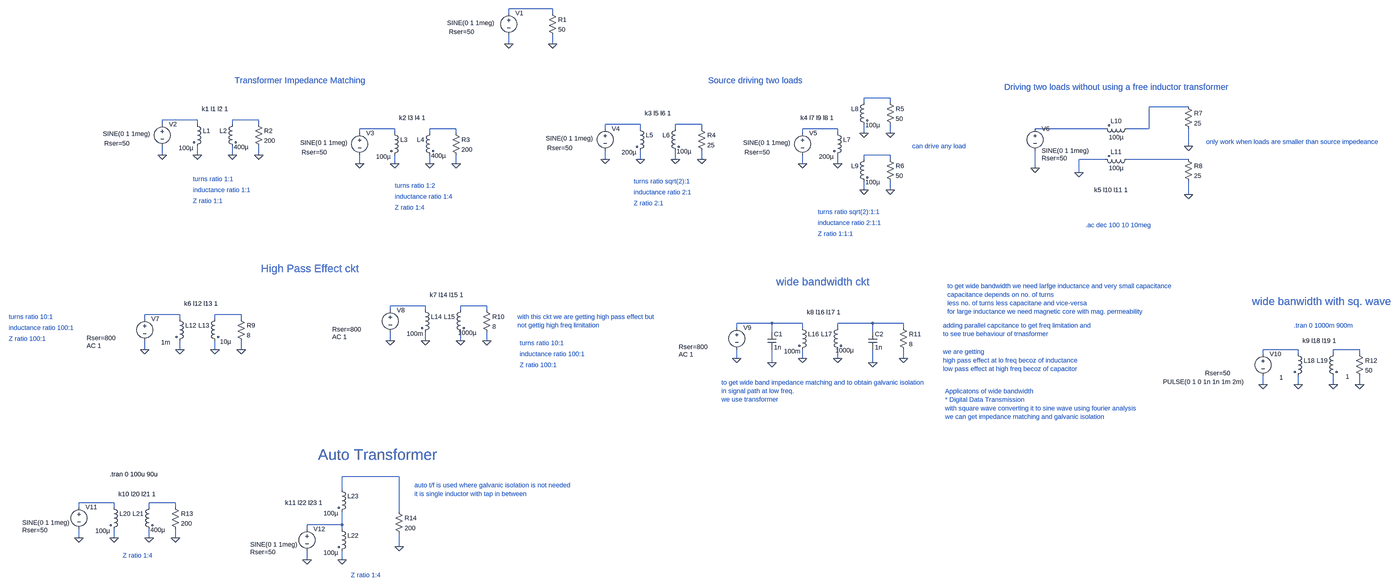
[diagram p0: schematic Wideband coupling (High coupling factor)- Transformer Impedance matching.asc, whole sheet]
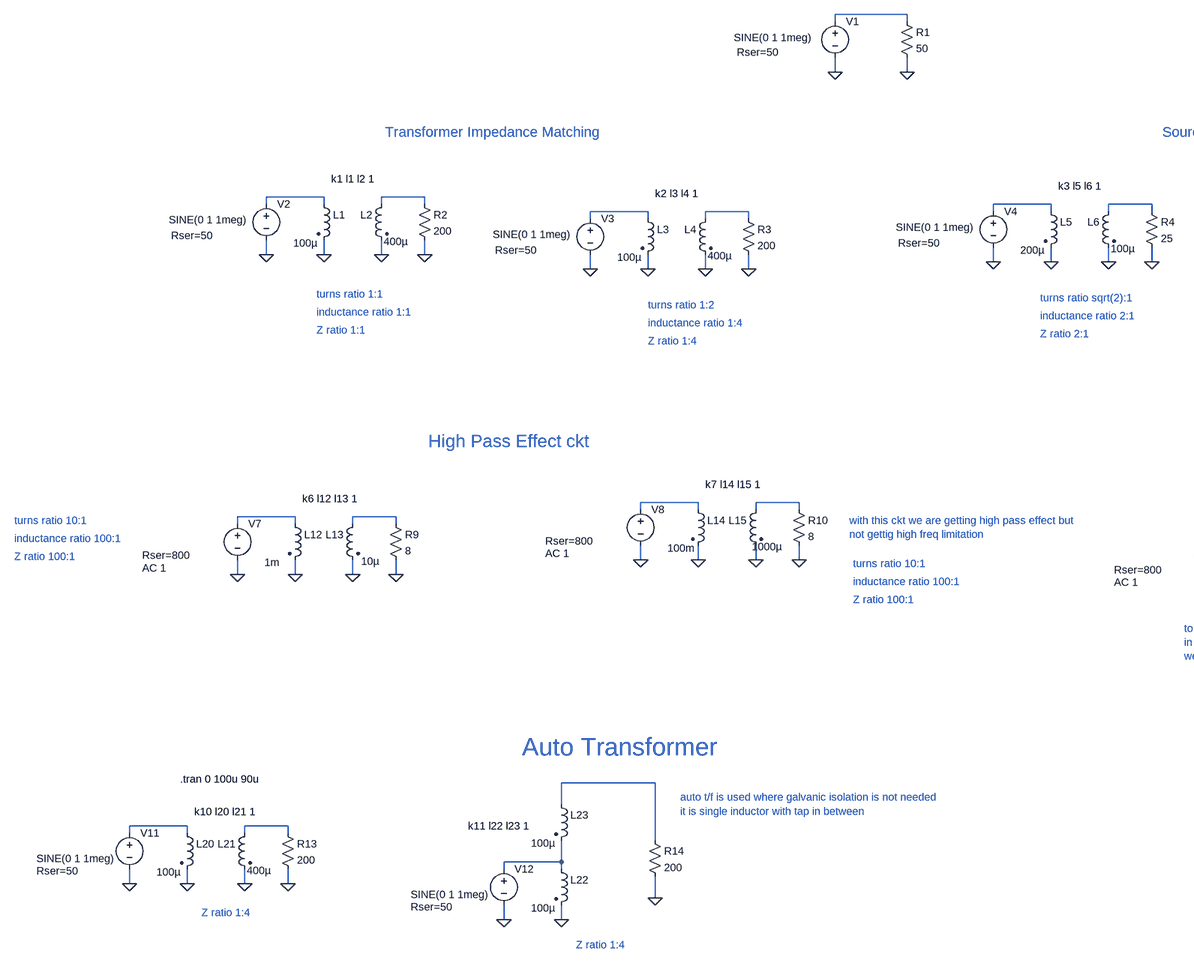
[diagram p1: schematic Wideband coupling (High coupling factor)- Transformer Impedance matching.asc, part, row 1 of 1, column 1 of 2]
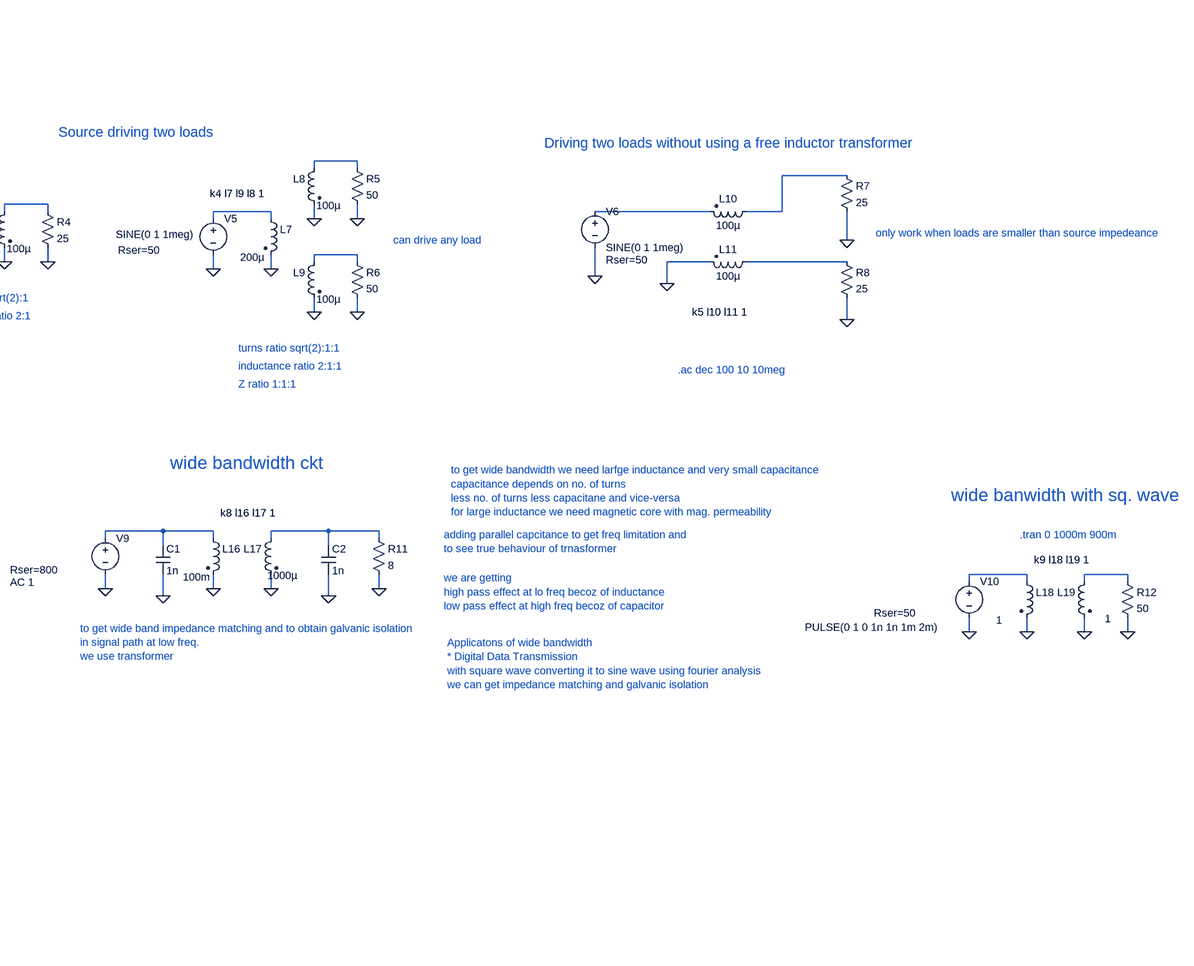
[diagram p2: schematic Wideband coupling (High coupling factor)- Transformer Impedance matching.asc, part, row 1 of 1, column 2 of 2]
Wideband coupling (High coupling factor)- Transformer Impedance matching.asc, the LTspice schematic file:
Version 4
SHEET 1 4592 2796
WIRE 1472 16 1312 16
WIRE 1312 32 1312 16
WIRE 1472 32 1472 16
WIRE 1312 144 1312 112
WIRE 1472 144 1472 112
WIRE 2704 352 2608 352
WIRE 2608 368 2608 352
WIRE 2704 368 2704 352
WIRE 3792 384 3648 384
WIRE 176 432 48 432
WIRE 400 432 304 432
WIRE 48 448 48 432
WIRE 176 448 176 432
WIRE 304 448 304 432
WIRE 400 448 400 432
WIRE 1792 448 1664 448
WIRE 2016 448 1920 448
WIRE 896 464 768 464
WIRE 1120 464 1024 464
WIRE 1664 464 1664 448
WIRE 1792 464 1792 448
WIRE 1920 464 1920 448
WIRE 2016 464 2016 448
WIRE 2512 464 2384 464
WIRE 3488 464 3232 464
WIRE 3648 464 3648 384
WIRE 3648 464 3568 464
WIRE 768 480 768 464
WIRE 896 480 896 464
WIRE 1024 480 1024 464
WIRE 1120 480 1120 464
WIRE 2384 480 2384 464
WIRE 2512 480 2512 464
WIRE 2608 480 2608 448
WIRE 2704 480 2704 448
WIRE 3792 528 3792 464
WIRE 48 560 48 528
WIRE 176 560 176 528
WIRE 304 560 304 528
WIRE 400 560 400 528
WIRE 2704 560 2608 560
WIRE 1664 576 1664 544
WIRE 1792 576 1792 544
WIRE 1920 576 1920 544
WIRE 2016 576 2016 544
WIRE 2608 576 2608 560
WIRE 2704 576 2704 560
WIRE 3488 576 3392 576
WIRE 3792 576 3568 576
WIRE 768 592 768 560
WIRE 896 592 896 560
WIRE 1024 592 1024 560
WIRE 1120 592 1120 560
WIRE 2384 592 2384 560
WIRE 2512 592 2512 560
WIRE 3232 608 3232 544
WIRE 3392 624 3392 576
WIRE 2608 688 2608 656
WIRE 2704 688 2704 656
WIRE 3792 704 3792 656
WIRE 1008 1184 880 1184
WIRE 1232 1184 1136 1184
WIRE 880 1200 880 1184
WIRE 1008 1200 1008 1184
WIRE 1136 1200 1136 1184
WIRE 1232 1200 1232 1184
WIRE 112 1216 -16 1216
WIRE 336 1216 240 1216
WIRE -16 1232 -16 1216
WIRE 112 1232 112 1216
WIRE 240 1232 240 1216
WIRE 336 1232 336 1216
WIRE 2272 1248 2144 1248
WIRE 2384 1248 2272 1248
WIRE 2640 1248 2512 1248
WIRE 2752 1248 2640 1248
WIRE 2144 1264 2144 1248
WIRE 2384 1264 2384 1248
WIRE 2512 1264 2512 1248
WIRE 2752 1264 2752 1248
WIRE 2272 1280 2272 1248
WIRE 2640 1280 2640 1248
WIRE 880 1312 880 1280
WIRE 1008 1312 1008 1280
WIRE 1136 1312 1136 1280
WIRE 1232 1312 1232 1280
WIRE -16 1344 -16 1312
WIRE 112 1344 112 1312
WIRE 240 1344 240 1312
WIRE 336 1344 336 1312
WIRE 4192 1344 4064 1344
WIRE 4416 1344 4320 1344
WIRE 4064 1360 4064 1344
WIRE 4192 1360 4192 1344
WIRE 4320 1360 4320 1344
WIRE 4416 1360 4416 1344
WIRE 2144 1376 2144 1344
WIRE 2384 1376 2384 1344
WIRE 2512 1376 2512 1344
WIRE 2752 1376 2752 1344
WIRE 2272 1392 2272 1344
WIRE 2640 1392 2640 1344
WIRE 4064 1472 4064 1440
WIRE 4192 1472 4192 1440
WIRE 4320 1472 4320 1440
WIRE 4416 1472 4416 1440
WIRE 912 1856 704 1856
WIRE 704 1904 704 1856
WIRE -128 1952 -256 1952
WIRE 96 1952 0 1952
WIRE -256 1968 -256 1952
WIRE -128 1968 -128 1952
WIRE 0 1968 0 1952
WIRE 96 1968 96 1952
WIRE 912 1984 912 1856
WIRE 704 2032 704 1984
WIRE 704 2032 576 2032
WIRE 576 2048 576 2032
WIRE 704 2048 704 2032
WIRE -256 2080 -256 2048
WIRE -128 2080 -128 2048
WIRE 0 2080 0 2048
WIRE 96 2080 96 2048
WIRE 912 2112 912 2064
WIRE 576 2160 576 2128
WIRE 704 2160 704 2128
FLAG 1312 144 0
FLAG 1472 144 0
FLAG 400 560 0
FLAG 304 560 0
FLAG 176 560 0
FLAG 48 560 0
FLAG 1120 592 0
FLAG 1024 592 0
FLAG 896 592 0
FLAG 768 592 0
FLAG 2016 576 0
FLAG 1920 576 0
FLAG 1792 576 0
FLAG 1664 576 0
FLAG 2512 592 0
FLAG 2384 592 0
FLAG 2704 480 0
FLAG 2608 480 0
FLAG 2704 688 0
FLAG 2608 688 0
FLAG 3232 608 0
FLAG 3392 624 0
FLAG 3792 528 0
FLAG 3792 704 0
FLAG 336 1344 0
FLAG 240 1344 0
FLAG 112 1344 0
FLAG -16 1344 0
FLAG 1232 1312 0
FLAG 1136 1312 0
FLAG 1008 1312 0
FLAG 880 1312 0
FLAG 2752 1376 0
FLAG 2512 1376 0
FLAG 2384 1376 0
FLAG 2144 1376 0
FLAG 2272 1392 0
FLAG 2640 1392 0
FLAG 4416 1472 0
FLAG 4320 1472 0
FLAG 4192 1472 0
FLAG 4064 1472 0
FLAG 96 2080 0
FLAG 0 2080 0
FLAG -128 2080 0
FLAG -256 2080 0
FLAG 704 2160 0
FLAG 576 2160 0
FLAG 912 2112 0
SYMBOL res 1456 16 R0
SYMATTR InstName R1
SYMATTR Value 50
SYMBOL voltage 1312 16 R0
WINDOW 3 -225 52 Left 2
WINDOW 123 0 0 Left 0
WINDOW 39 -218 84 Left 2
SYMATTR InstName V1
SYMATTR Value SINE(0 1 1meg)
SYMATTR SpiceLine Rser=50
SYMBOL voltage 48 432 R0
WINDOW 3 -217 51 Left 2
WINDOW 123 0 0 Left 0
WINDOW 39 -212 86 Left 2
SYMATTR InstName V2
SYMATTR Value SINE(0 1 1meg)
SYMATTR SpiceLine Rser=50
SYMBOL ind2 160 432 R0
WINDOW 3 -52 102 Left 2
SYMATTR InstName L1
SYMATTR Value 100µ
SYMBOL ind2 320 432 M0
WINDOW 3 -43 99 Left 2
SYMATTR InstName L2
SYMATTR Value 400µ
SYMBOL res 384 432 R0
SYMATTR InstName R2
SYMATTR Value 200
SYMBOL voltage 768 464 R0
WINDOW 3 -217 51 Left 2
WINDOW 123 0 0 Left 0
WINDOW 39 -212 86 Left 2
SYMATTR InstName V3
SYMATTR Value SINE(0 1 1meg)
SYMATTR SpiceLine Rser=50
SYMBOL ind2 880 464 R0
WINDOW 3 -52 102 Left 2
SYMATTR InstName L3
SYMATTR Value 100µ
SYMBOL ind2 1040 464 M0
WINDOW 3 -43 99 Left 2
SYMATTR InstName L4
SYMATTR Value 400µ
SYMBOL res 1104 464 R0
SYMATTR InstName R3
SYMATTR Value 200
SYMBOL voltage 1664 448 R0
WINDOW 3 -217 51 Left 2
WINDOW 123 0 0 Left 0
WINDOW 39 -212 86 Left 2
SYMATTR InstName V4
SYMATTR Value SINE(0 1 1meg)
SYMATTR SpiceLine Rser=50
SYMBOL ind2 1776 448 R0
WINDOW 3 -52 102 Left 2
SYMATTR InstName L5
SYMATTR Value 200µ
SYMBOL ind2 1936 448 M0
WINDOW 3 -43 99 Left 2
SYMATTR InstName L6
SYMATTR Value 100µ
SYMBOL res 2000 448 R0
SYMATTR InstName R4
SYMATTR Value 25
SYMBOL voltage 2384 464 R0
WINDOW 3 -217 51 Left 2
WINDOW 123 0 0 Left 0
WINDOW 39 -212 86 Left 2
SYMATTR InstName V5
SYMATTR Value SINE(0 1 1meg)
SYMATTR SpiceLine Rser=50
SYMBOL ind2 2496 464 R0
WINDOW 3 -52 102 Left 2
SYMATTR InstName L7
SYMATTR Value 200µ
SYMBOL ind2 2624 352 M0
WINDOW 3 -43 99 Left 2
SYMATTR InstName L8
SYMATTR Value 100µ
SYMBOL res 2688 352 R0
SYMATTR InstName R5
SYMATTR Value 50
SYMBOL ind2 2624 560 M0
WINDOW 3 -43 99 Left 2
SYMATTR InstName L9
SYMATTR Value 100µ
SYMBOL res 2688 560 R0
SYMATTR InstName R6
SYMATTR Value 50
SYMBOL voltage 3232 448 R0
WINDOW 123 0 0 Left 0
WINDOW 39 24 124 Left 2
SYMATTR InstName V6
SYMATTR Value SINE(0 1 1meg)
SYMATTR SpiceLine Rser=50
SYMBOL ind2 3584 448 R90
WINDOW 0 4 56 VBottom 2
WINDOW 3 32 56 VTop 2
SYMATTR InstName L10
SYMATTR Value 100µ
SYMBOL ind2 3584 560 R90
WINDOW 0 4 56 VBottom 2
WINDOW 3 32 56 VTop 2
SYMATTR InstName L11
SYMATTR Value 100µ
SYMBOL res 3776 368 R0
SYMATTR InstName R7
SYMATTR Value 25
SYMBOL res 3776 560 R0
SYMATTR InstName R8
SYMATTR Value 25
SYMBOL voltage -16 1216 R0
WINDOW 3 -217 51 Left 2
WINDOW 123 -212 114 Left 2
WINDOW 39 -212 86 Left 2
SYMATTR InstName V7
SYMATTR Value ""
SYMATTR Value2 AC 1
SYMATTR SpiceLine Rser=800
SYMBOL ind2 96 1216 R0
WINDOW 3 -52 102 Left 2
SYMATTR InstName L12
SYMATTR Value 1m
SYMBOL ind2 256 1216 M0
WINDOW 3 -43 99 Left 2
SYMATTR InstName L13
SYMATTR Value 10µ
SYMBOL res 320 1216 R0
SYMATTR InstName R9
SYMATTR Value 8
SYMBOL voltage 880 1184 R0
WINDOW 3 -217 51 Left 2
WINDOW 123 -212 114 Left 2
WINDOW 39 -212 86 Left 2
SYMATTR InstName V8
SYMATTR Value ""
SYMATTR Value2 AC 1
SYMATTR SpiceLine Rser=800
SYMBOL ind2 992 1184 R0
WINDOW 3 -52 102 Left 2
SYMATTR InstName L14
SYMATTR Value 100m
SYMBOL ind2 1152 1184 M0
WINDOW 3 -43 99 Left 2
SYMATTR InstName L15
SYMATTR Value 1000µ
SYMBOL res 1216 1184 R0
SYMATTR InstName R10
SYMATTR Value 8
SYMBOL voltage 2144 1248 R0
WINDOW 3 -217 51 Left 2
WINDOW 123 -212 114 Left 2
WINDOW 39 -212 86 Left 2
SYMATTR InstName V9
SYMATTR Value ""
SYMATTR Value2 AC 1
SYMATTR SpiceLine Rser=800
SYMBOL ind2 2368 1248 R0
WINDOW 3 -52 102 Left 2
SYMATTR InstName L16
SYMATTR Value 100m
SYMBOL ind2 2528 1248 M0
WINDOW 3 -43 99 Left 2
SYMATTR InstName L17
SYMATTR Value 1000µ
SYMBOL res 2736 1248 R0
SYMATTR InstName R11
SYMATTR Value 8
SYMBOL cap 2256 1280 R0
SYMATTR InstName C1
SYMATTR Value 1n
SYMBOL cap 2624 1280 R0
SYMATTR InstName C2
SYMATTR Value 1n
SYMBOL voltage 4064 1344 R0
WINDOW 3 -365 118 Left 2
WINDOW 123 -212 114 Left 2
WINDOW 39 -212 86 Left 2
SYMATTR InstName V10
SYMATTR Value PULSE(0 1 0 1n 1n 1m 2m)
SYMATTR SpiceLine Rser=50
SYMBOL ind2 4176 1344 R0
WINDOW 3 -52 102 Left 2
SYMATTR InstName L18
SYMATTR Value 1
SYMBOL ind2 4336 1344 M0
WINDOW 3 -43 99 Left 2
SYMATTR InstName L19
SYMATTR Value 1
SYMBOL res 4400 1344 R0
SYMATTR InstName R12
SYMATTR Value 50
SYMBOL ind2 -144 1952 R0
WINDOW 3 -52 102 Left 2
SYMATTR InstName L20
SYMATTR Value 100µ
SYMBOL ind2 16 1952 M0
WINDOW 3 -43 99 Left 2
SYMATTR InstName L21
SYMATTR Value 400µ
SYMBOL res 80 1952 R0
SYMATTR InstName R13
SYMATTR Value 200
SYMBOL voltage -256 1952 R0
WINDOW 3 -207 72 Left 2
WINDOW 123 0 0 Left 0
WINDOW 39 -207 100 Left 2
SYMATTR InstName V11
SYMATTR Value SINE(0 1 1meg)
SYMATTR SpiceLine Rser=50
SYMBOL ind2 688 2032 R0
WINDOW 3 -52 102 Left 2
SYMATTR InstName L22
SYMATTR Value 100µ
SYMBOL voltage 576 2032 R0
WINDOW 3 -207 72 Left 2
WINDOW 123 0 0 Left 0
WINDOW 39 -207 100 Left 2
SYMATTR InstName V12
SYMATTR Value SINE(0 1 1meg)
SYMATTR SpiceLine Rser=50
SYMBOL ind2 688 1888 R0
WINDOW 3 -52 102 Left 2
SYMATTR InstName L23
SYMATTR Value 100µ
SYMBOL res 896 1968 R0
SYMATTR InstName R14
SYMATTR Value 200
TEXT 160 648 Left 2 ;turns ratio 1:1
TEXT 160 688 Left 2 ;inductance ratio 1:1
TEXT 160 728 Left 2 ;Z ratio 1:1
TEXT 192 392 Left 2 !k1 l1 l2 1
TEXT 896 672 Left 2 ;turns ratio 1:2
TEXT 896 712 Left 2 ;inductance ratio 1:4
TEXT 896 752 Left 2 ;Z ratio 1:4
TEXT 912 424 Left 2 !k2 l3 l4 1
TEXT 312 288 Left 3 ;Transformer Impedance Matching
TEXT 1768 656 Left 2 ;turns ratio sqrt(2):1
TEXT 1768 696 Left 2 ;inductance ratio 2:1
TEXT 1768 736 Left 2 ;Z ratio 2:1
TEXT 1808 408 Left 2 !k3 l5 l6 1
TEXT 2440 768 Left 2 ;turns ratio sqrt(2):1:1
TEXT 2440 808 Left 2 ;inductance ratio 2:1:1
TEXT 2440 848 Left 2 ;Z ratio 1:1:1
TEXT 2376 424 Left 2 !k4 l7 l9 l8 1
TEXT 2040 288 Left 3 ;Source driving two loads
TEXT 3120 312 Left 3 ;Driving two loads without using a free inductor transformer
TEXT 3448 688 Left 2 !k5 l10 l11 1
TEXT 3856 512 Left 2 ;only work when loads are smaller than source impedeance
TEXT 2784 528 Left 2 ;can drive any load
TEXT -512 1224 Left 2 ;turns ratio 10:1
TEXT -512 1264 Left 2 ;inductance ratio 100:1
TEXT -512 1304 Left 2 ;Z ratio 100:1
TEXT 128 1176 Left 2 !k6 l12 l13 1
TEXT 1352 1320 Left 2 ;turns ratio 10:1
TEXT 1352 1360 Left 2 ;inductance ratio 100:1
TEXT 1352 1400 Left 2 ;Z ratio 100:1
TEXT 1024 1144 Left 2 !k7 l14 l15 1
TEXT 1344 1224 Left 2 ;with this ckt we are getting high pass effect but \nnot gettig high freq limitation
TEXT 2400 1208 Left 2 !k8 l16 l17 1
TEXT 2896 1256 Left 2 ;adding parallel capcitance to get freq limitation and \nto see true behaviour of trnasformer
TEXT 2896 1352 Left 2 ;we are getting \nhigh pass effect at lo freq becoz of inductance \nlow pass effect at high freq becoz of capacitor
TEXT 2288 1096 Left 4 ;wide bandwidth ckt
TEXT 2912 1112 Left 2 ;to get wide bandwidth we need larfge inductance and very small capacitance\ncapacitance depends on no. of turns\nless no. of turns less capacitane and vice-versa\nfor large inductance we need magnetic core with mag. permeability
TEXT 2088 1464 Left 2 ;to get wide band impedance matching and to obtain galvanic isolation \nin signal path at low freq.\nwe use transformer
TEXT 2904 1496 Left 2 ;Applicatons of wide bandwidth \n* Digital Data Transmission\nwith square wave converting it to sine wave using fourier analysis\nwe can get impedance matching and galvanic isolation
TEXT 4208 1312 Left 2 !k9 l18 l19 1
TEXT 3416 816 Left 2 ;.ac dec 100 10 10meg
TEXT -112 1920 Left 2 !k10 l20 l21 1
TEXT -96 2144 Left 2 ;Z ratio 1:4
TEXT 496 1952 Left 2 !k11 l22 l23 1
TEXT 736 2216 Left 2 ;Z ratio 1:4
TEXT 4176 1256 Left 2 ;.tran 0 1000m 900m
TEXT -144 1848 Left 2 !.tran 0 100u 90u
TEXT 616 1776 Left 5 ;Auto Transformer
TEXT 968 1888 Left 2 ;auto t/f is used where galvanic isolation is not needed\nit is single inductor with tap in between
TEXT 4024 1168 Left 4 ;wide banwidth with sq. wave
TEXT 408 1048 Left 4 ;High Pass Effect ckt

The netlist it stands for:
* Wideband coupling (High coupling factor)- Transformer Impedance matching.asc
R1 N001 0 50
V1 N001 0 SINE(0 1 1meg) Rser=50
V2 N004 0 SINE(0 1 1meg) Rser=50
L1 N004 0 100µ
L2 N005 0 400µ
R2 N005 0 200
V3 N008 0 SINE(0 1 1meg) Rser=50
L3 N008 0 100µ
L4 N009 0 400µ
R3 N009 0 200
V4 N006 0 SINE(0 1 1meg) Rser=50
L5 N006 0 200µ
L6 N007 0 100µ
R4 N007 0 25
V5 N010 0 SINE(0 1 1meg) Rser=50
L7 N010 0 200µ
L8 N002 0 100µ
R5 N002 0 50
L9 N012 0 100µ
R6 N012 0 50
V6 N011 0 SINE(0 1 1meg) Rser=50
L10 N003 N011 100µ
L11 N013 0 100µ
R7 N003 0 25
R8 N013 0 25
V7 N016 0 AC 1 Rser=800
L12 N016 0 1m
L13 N017 0 10µ
R9 N017 0 8
V8 N014 0 AC 1 Rser=800
L14 N014 0 100m
L15 N015 0 1000µ
R10 N015 0 8
V9 N018 0 AC 1 Rser=800
L16 N018 0 100m
L17 N019 0 1000µ
R11 N019 0 8
C1 N018 0 1n
C2 N019 0 1n
V10 N020 0 PULSE(0 1 0 1n 1n 1m 2m) Rser=50
L18 N020 0 1
L19 N021 0 1
R12 N021 0 50
L20 N023 0 100µ
L21 N024 0 400µ
R13 N024 0 200
V11 N023 0 SINE(0 1 1meg) Rser=50
L22 N025 0 100µ
V12 N025 0 SINE(0 1 1meg) Rser=50
L23 N022 N025 100µ
R14 N022 0 200
* turns ratio 1:1
* inductance ratio 1:1
* Z ratio 1:1
k1 l1 l2 1
* turns ratio 1:2
* inductance ratio 1:4
* Z ratio 1:4
k2 l3 l4 1
* Transformer Impedance Matching
* turns ratio sqrt(2):1
* inductance ratio 2:1
* Z ratio 2:1
k3 l5 l6 1
* turns ratio sqrt(2):1:1
* inductance ratio 2:1:1
* Z ratio 1:1:1
k4 l7 l9 l8 1
* Source driving two loads
* Driving two loads without using a free inductor transformer
k5 l10 l11 1
* only work when loads are smaller than source impedeance
* can drive any load
* turns ratio 10:1
* inductance ratio 100:1
* Z ratio 100:1
k6 l12 l13 1
* turns ratio 10:1
* inductance ratio 100:1
* Z ratio 100:1
k7 l14 l15 1
* with this ckt we are getting high pass effect but
* not gettig high freq limitation
k8 l16 l17 1
* adding parallel capcitance to get freq limitation and
* to see true behaviour of trnasformer
* we are getting
* high pass effect at lo freq becoz of inductance
* low pass effect at high freq becoz of capacitor
* wide bandwidth ckt
* to get wide bandwidth we need larfge inductance and very small capacitance
* capacitance depends on no. of turns
* less no. of turns less capacitane and vice-versa
* for large inductance we need magnetic core with mag. permeability
* to get wide band impedance matching and to obtain galvanic isolation
* in signal path at low freq.
* we use transformer
* Applicatons of wide bandwidth
* * Digital Data Transmission
* with square wave converting it to sine wave using fourier analysis
* we can get impedance matching and galvanic isolation
k9 l18 l19 1
* .ac dec 100 10 10meg
k10 l20 l21 1
* Z ratio 1:4
k11 l22 l23 1
* Z ratio 1:4
* .tran 0 1000m 900m
.tran 0 100u 90u
* Auto Transformer
* auto t/f is used where galvanic isolation is not needed
* it is single inductor with tap in between
* wide banwidth with sq. wave
* High Pass Effect ckt
.backanno
.end